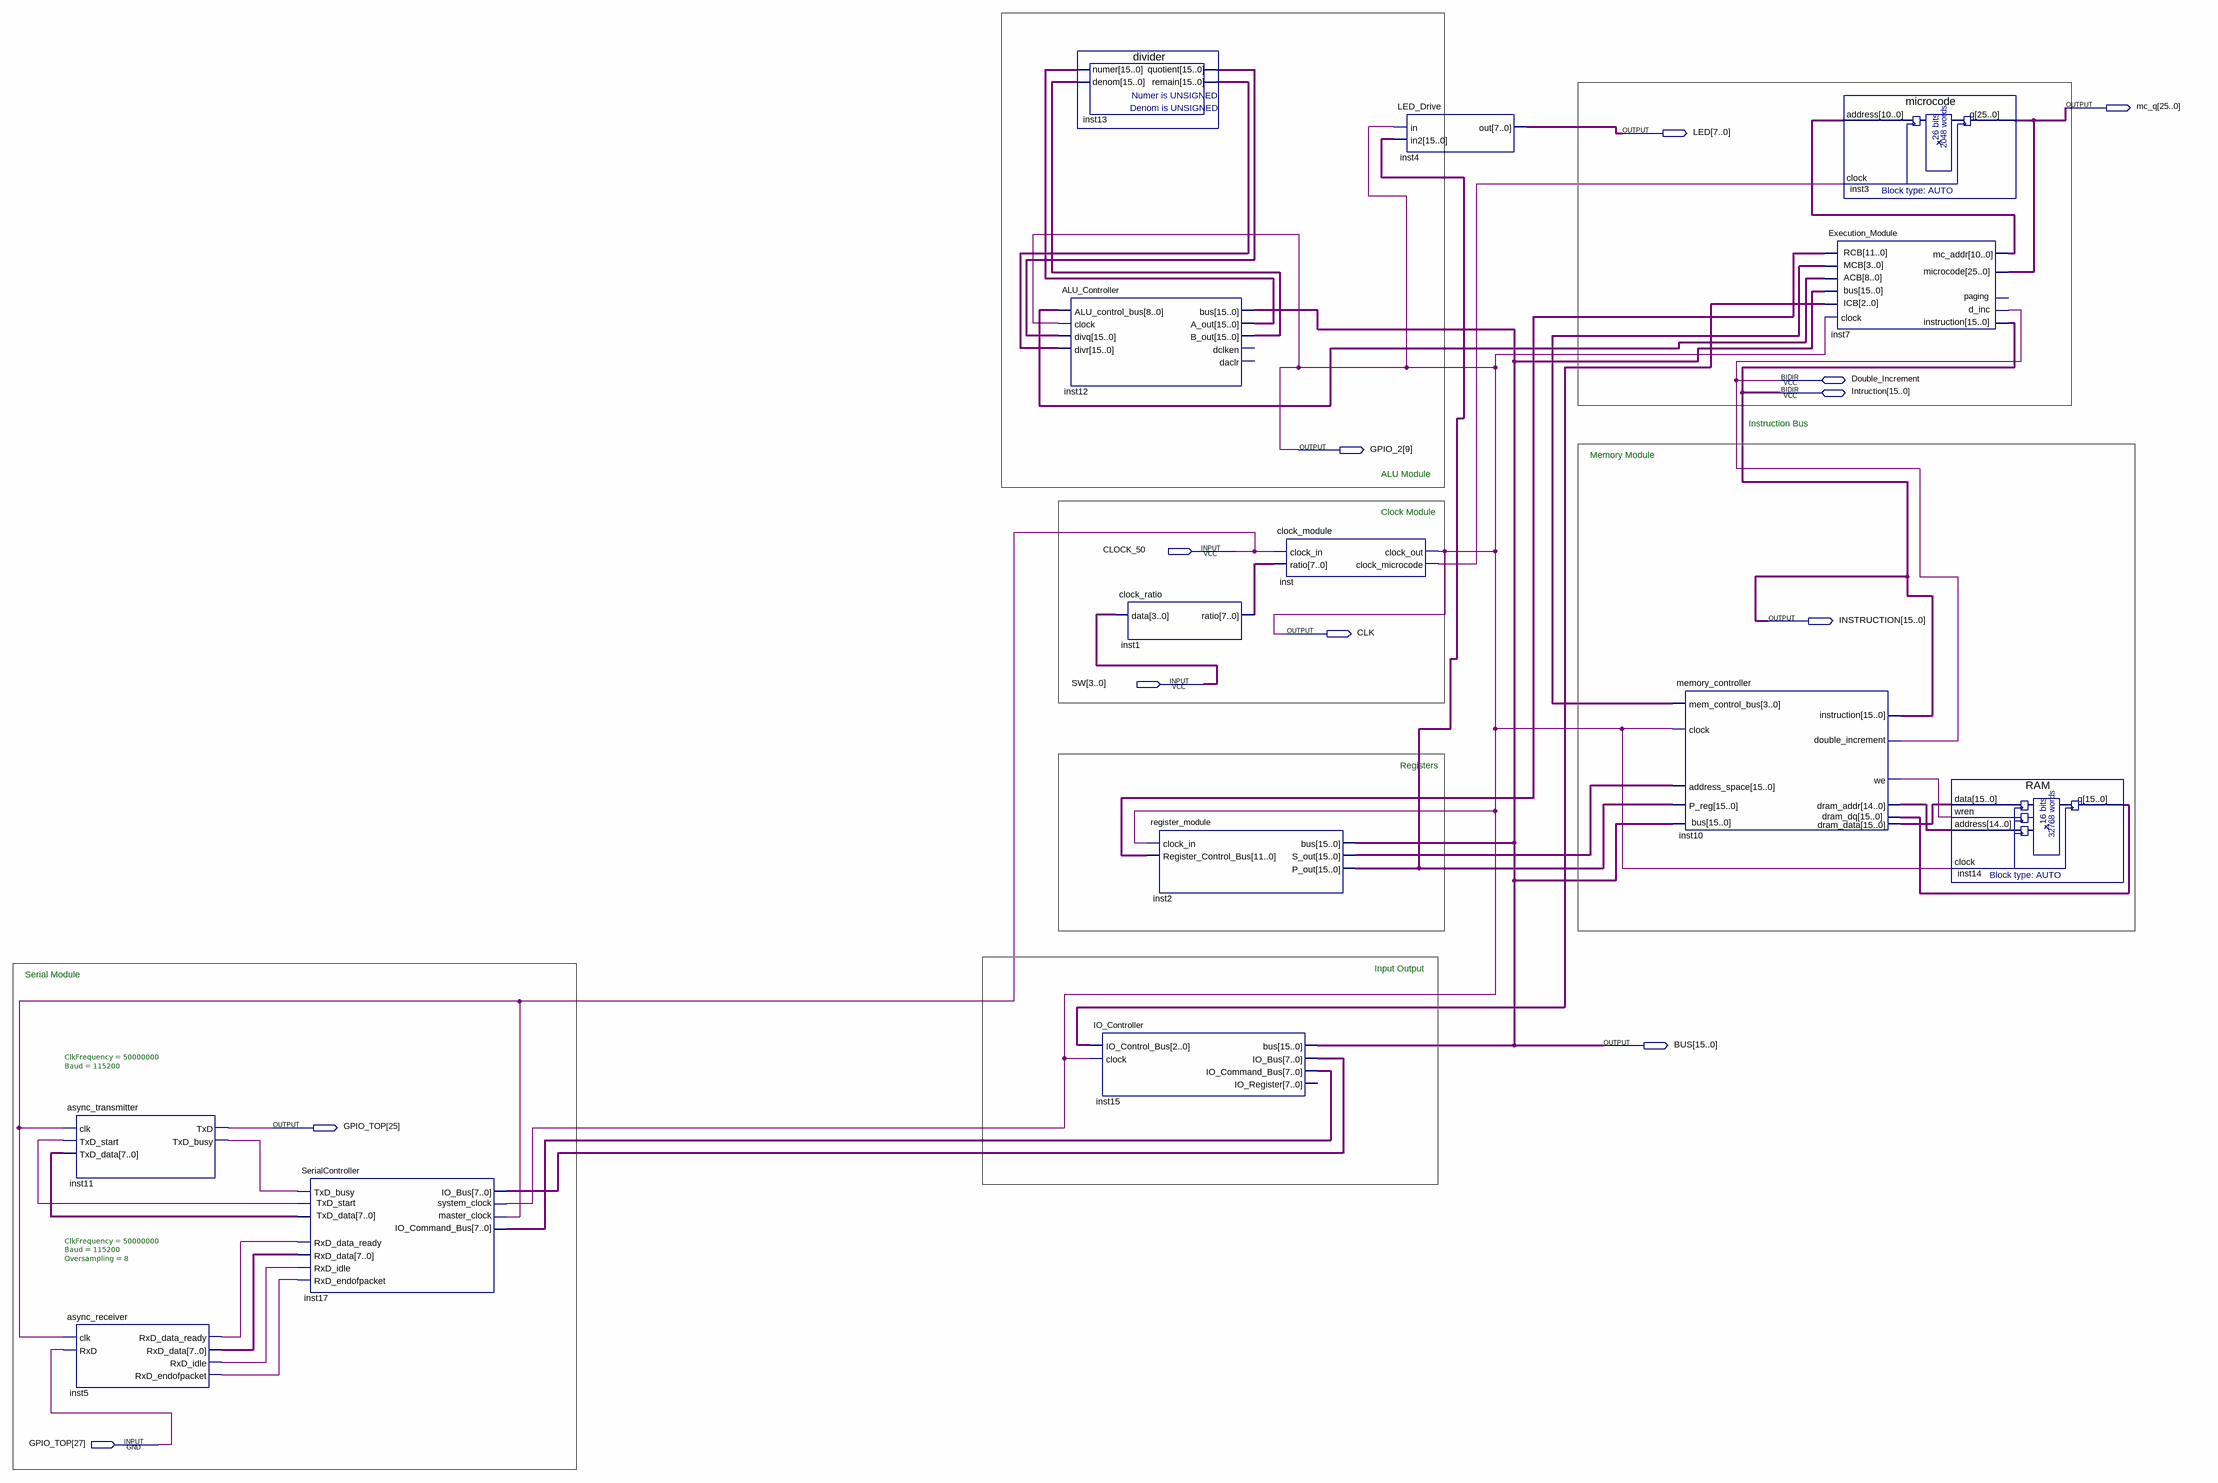
[diagram p0: schematic sheet]
// Quartus schematic CPU.bdf as structural Verilog: 14 symbols, 12 pins
module CPU (
  input  CLOCK_50,
  input  [3:0] SW,
  inout  [27:25] GPIO_TOP,
  inout  Double_Increment,
  inout  [15:0] Intruction,
  output [25:0] mc_q,
  output [7:0] LED,
  output [9:9] GPIO_2,
  output [15:0] INSTRUCTION,
  output CLK,
  output [15:0] BUS
);

  wire inst5_rxd_data_ready, inst5_rxd_endofpacket, inst5_rxd_idle, inst10_we, inst11_txd_busy,
       inst17_txd_start, inst_clock_microcode;
  wire [2:0] inst7_icb;
  wire [3:0] inst7_mcb;
  wire [7:0] inst1_ratio, inst5_rxd_data, inst15_io_command_bus, inst17_io_bus, inst17_txd_data;
  wire [8:0] inst7_acb;
  wire [10:0] inst7_mc_addr;
  wire [11:0] inst7_rcb;
  wire [14:0] inst10_dram_addr;
  wire [15:0] inst2_p_out, inst2_s_out, inst10_dram_data, inst12_a_out, inst12_b_out, inst13_quotient,
       inst13_remain, inst14_q;

  async_transmitter #(.ClkFrequency(50000000), .Baud(115200)) inst11 (
    .clk(CLOCK_50), .TxD_start(inst17_txd_start), .TxD_data(inst17_txd_data), .TxD(GPIO_TOP[25]),
    .TxD_busy(inst11_txd_busy));
  async_receiver #(.ClkFrequency(50000000), .Baud(115200), .Oversampling(8)) inst5 (
    .clk(CLOCK_50), .RxD(GPIO_TOP[27]), .RxD_data_ready(inst5_rxd_data_ready), .RxD_data(inst5_rxd_data),
    .RxD_idle(inst5_rxd_idle), .RxD_endofpacket(inst5_rxd_endofpacket));
  SerialController inst17 (
    .IO_Command_Bus(inst15_io_command_bus), .system_clock(CLK), .master_clock(CLOCK_50),
    .TxD_busy(inst11_txd_busy), .RxD_data_ready(inst5_rxd_data_ready), .RxD_data(inst5_rxd_data),
    .RxD_idle(inst5_rxd_idle), .RxD_endofpacket(inst5_rxd_endofpacket), .TxD_start(inst17_txd_start),
    .TxD_data(inst17_txd_data), .IO_Bus(inst17_io_bus));
  divider inst13 (.numer(inst12_a_out), .denom(inst12_b_out), .quotient(inst13_quotient), .remain(inst13_remain));
  ALU_Controller inst12 (
    .clock(CLK), .divq(inst13_quotient), .divr(inst13_remain), .ALU_control_bus(inst7_acb),
    .A_out(inst12_a_out), .B_out(inst12_b_out), .bus(BUS));  // open: dclken, daclr
  clock_ratio inst1 (.data(SW), .ratio(inst1_ratio));
  IO_Controller inst15 (
    .IO_Control_Bus(inst7_icb), .clock(CLK), .IO_Command_Bus(inst15_io_command_bus), .bus(BUS),
    .IO_Bus(inst17_io_bus));  // open: IO_Register
  register_module inst2 (
    .clock_in(CLK), .Register_Control_Bus(inst7_rcb), .S_out(inst2_s_out), .P_out(inst2_p_out), .bus(BUS));
  clock_module inst (.clock_in(CLOCK_50), .ratio(inst1_ratio), .clock_out(CLK), .clock_microcode(inst_clock_microcode));
  LED_Drive inst4 (.in(CLK), .in2(inst2_p_out), .out(LED));
  memory_controller inst10 (
    .dram_dq(inst14_q), .address_space(inst2_s_out), .mem_control_bus(inst7_mcb), .clock(CLK),
    .P_reg(inst2_p_out), .we(inst10_we), .dram_addr(inst10_dram_addr), .dram_data(inst10_dram_data),
    .double_increment(Double_Increment), .instruction(Intruction), .bus(BUS));
  Execution_Module inst7 (
    .clock(CLK), .d_inc(Double_Increment), .instruction(Intruction), .microcode(mc_q), .RCB(inst7_rcb),
    .MCB(inst7_mcb), .ACB(inst7_acb), .ICB(inst7_icb), .mc_addr(inst7_mc_addr), .bus(BUS));  // open: paging
  microcode inst3 (.address(inst7_mc_addr), .clock(inst_clock_microcode), .q(mc_q));
  RAM inst14 (.data(inst10_dram_data), .wren(inst10_we), .address(inst10_dram_addr), .clock(CLK), .q(inst14_q));

  assign GPIO_2[9] = CLK;
  assign INSTRUCTION = Intruction;

  // Notes on the sheet:
  //   Instruction Bus
  //   Memory Module
  //   ALU Module
  //   Clock Module
  //   Registers
  //   Input Output
  //   Serial Module
endmodule
